# EAGLE schematic RPI Trivia Hat (EAGLE 7.2.0)
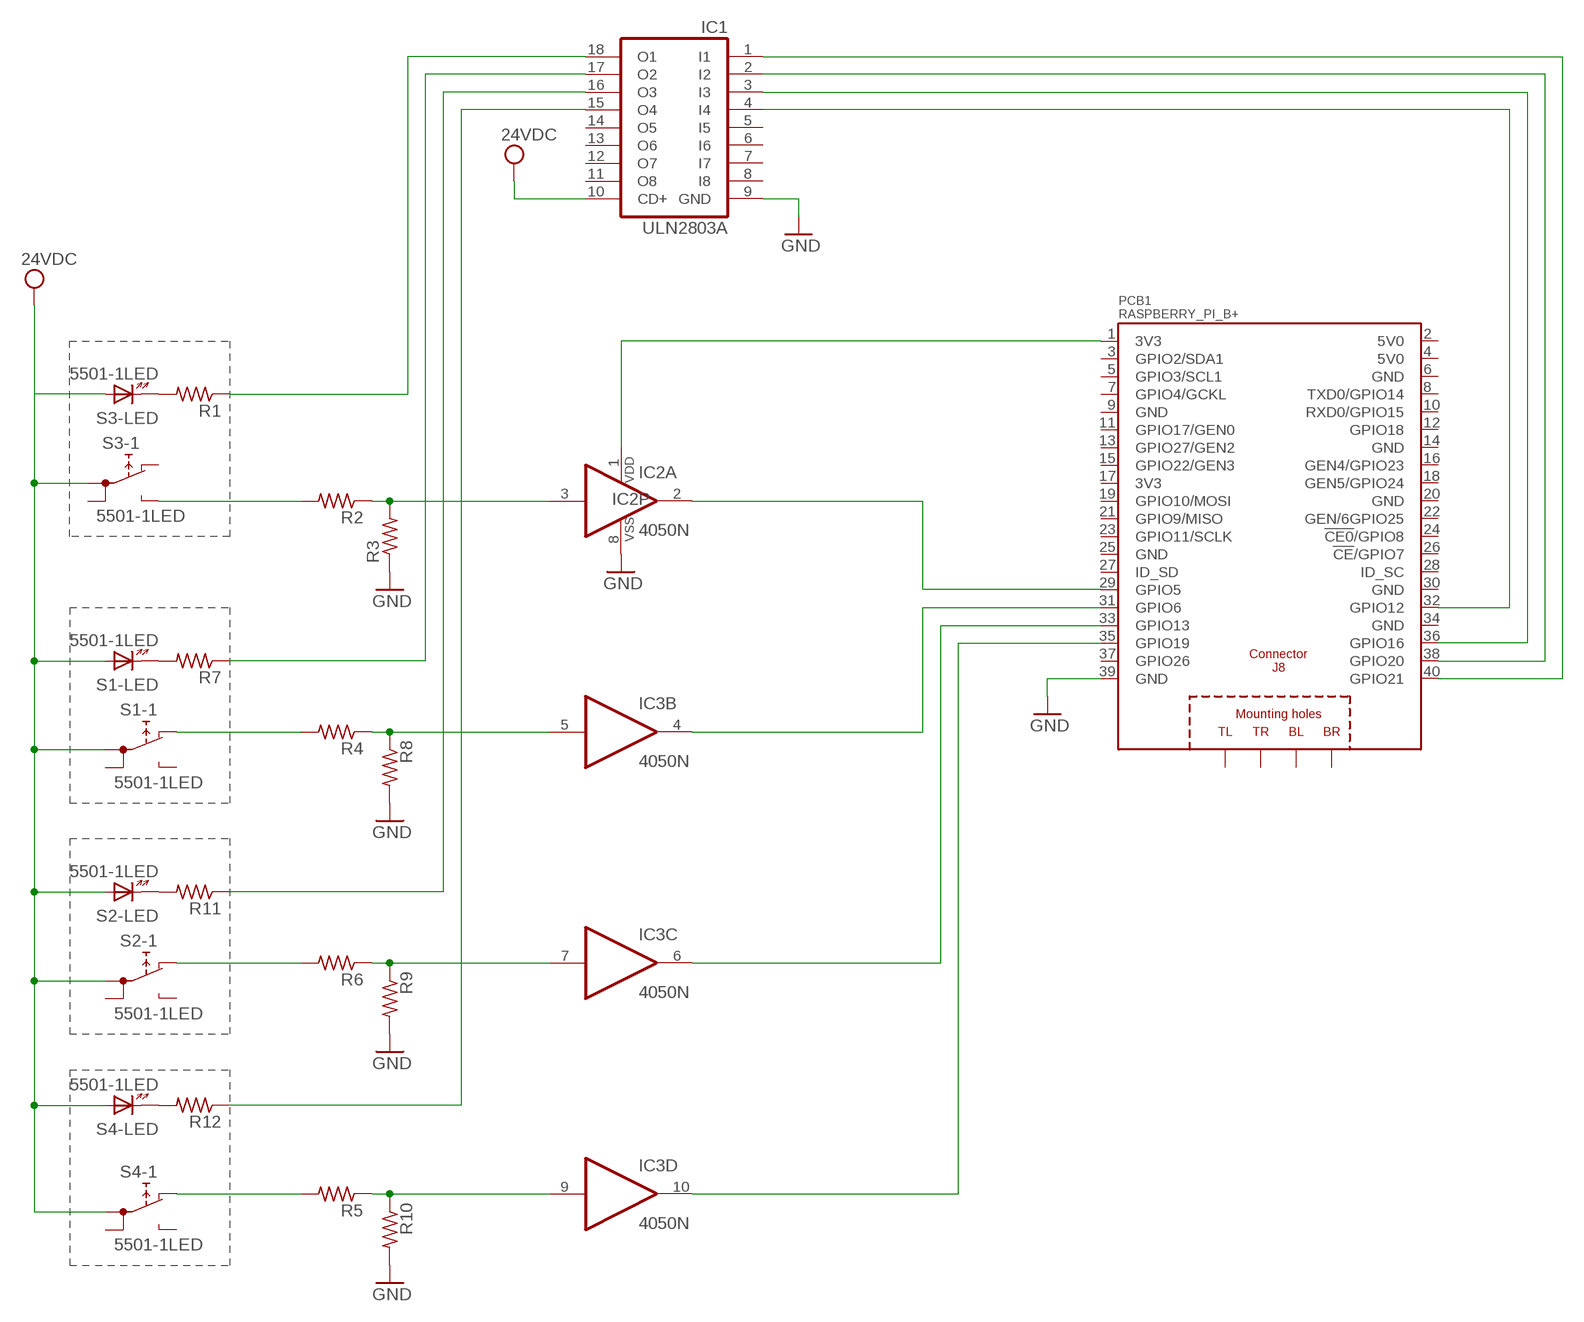
[diagram p0: schematic, sheet 1]

## Parts
IC1  ULN2803A  [DIL18]
IC2  4050N  [DIL16]
IC3  4050N  [DIL16]
PCB1  RASPBERRY_PI_B+  [RASPBERRY_PI_B+]
R1  R-US_0204/7  [0204/7]
R2  R-US_0204/7  [0204/7]
R3  R-US_0204/7  [0204/7]
R4  R-US_0204/7  [0204/7]
R5  R-US_0204/7  [0204/7]
R6  R-US_0204/7  [0204/7]
R7  R-US_0204/7  [0204/7]
R8  R-US_0204/7  [0204/7]
R9  R-US_0204/7  [0204/7]
R10  R-US_0204/7  [0204/7]
R11  R-US_0204/7  [0204/7]
R12  R-US_0204/7  [0204/7]
S1  5501-1LED  [5501-1LED]
S2  5501-1LED  [5501-1LED]
S3  5501-1LED  [5501-1LED]
S4  5501-1LED  [5501-1LED]

## Nets
3V3@1: IC2.1(P:VDD) PCB1.1(3V3)
GND: IC1.9(GND) IC2.8(P:VSS) PCB1.39(GND) R3.1 R8.2 R9.2 R10.2
N$1: R1.2 S3.-(-LED:K)
N$2: R2.2 S3.NO(-1:NO)
N$3: IC2.3(A:I) R2.1 R3.2
N$4: IC2.2(A:O) PCB1.29(GPIO5)
N$5: R4.2 S1.NC(-1:NC)
N$6: IC1.18(O1) R1.1
N$7: IC3.5(B:I) R4.1 R8.1
N$8: R6.2 S2.NC(-1:NC)
N$9: IC3.7(C:I) R6.1 R9.1
N$10: R5.2 S4.NC(-1:NC)
N$11: IC3.9(D:I) R5.1 R10.1
N$12: R7.2 S1.-(-LED:K)
N$13: R11.2 S2.-(-LED:K)
N$14: R12.2 S4.-(-LED:K)
N$15: IC1.15(O4) R12.1
N$16: IC3.4(B:O) PCB1.31(GPIO6)
N$17: IC3.6(C:O) PCB1.33(GPIO13)
N$18: IC3.10(D:O) PCB1.35(GPIO19)
N$19: IC1.17(O2) R7.1
N$20: IC1.16(O3) R11.1
N$21: IC1.1(I1) PCB1.40(GPIO21)
N$22: IC1.2(I2) PCB1.38(GPIO20)
N$23: IC1.3(I3) PCB1.36(GPIO16)
N$24: IC1.4(I4) PCB1.32(GPIO12)
VDD: IC1.10(CD+) S1.1A(-1:1A) S1.+(-LED:A) S2.1A(-1:1A) S2.+(-LED:A) S3.1A(-1:1A) S3.+(-LED:A) S4.1A(-1:1A) S4.+(-LED:A) ; supply symbol labelled 24VDC
Unconnected: IC1.5(I5) IC1.6(I6) IC1.7(I7) IC1.8(I8) IC1.11(O8) IC1.12(O7) IC1.13(O6) IC1.14(O5) IC2.4(B:O) IC2.5(B:I) IC2.6(C:O) IC2.7(C:I) IC2.9(D:I) IC2.10(D:O) IC2.11(E:I) IC2.12(E:O) IC2.14(F:I) IC2.15(F:O) IC3.2(A:O) IC3.3(A:I) IC3.11(E:I) IC3.12(E:O) IC3.14(F:I) IC3.15(F:O) PCB1.2(5V0) PCB1.3(GPIO2/SDA1) PCB1.4(5V0) PCB1.5(GPIO3/SCL1) PCB1.6(GND) PCB1.7(GPIO4/GCKL) PCB1.8(TXD0/GPIO14) PCB1.9(GND) PCB1.10(RXD0/GPIO15) PCB1.11(GPIO17/GEN0) PCB1.12(GPIO18) PCB1.13(GPIO27/GEN2) PCB1.14(GND) PCB1.15(GPIO22/GEN3) PCB1.16(GEN4/GPIO23) PCB1.17(3V3) PCB1.18(GEN5/GPIO24) PCB1.19(GPIO10/MOSI) PCB1.20(GND) PCB1.21(GPIO9/MISO) PCB1.22(GEN/6GPIO25) PCB1.23(GPIO11/SCLK) PCB1.24(!CE0!/GPIO8) PCB1.25(GND) PCB1.26(!CE!/GPIO7) PCB1.27(ID_SD) PCB1.28(ID_SC) PCB1.30(GND) PCB1.34(GND) PCB1.37(GPIO26) PCB1.PE_BL(BL) PCB1.PE_BR(BR) PCB1.PE_TL(TL) PCB1.PE_TR(TR) S1.1B(-1:1B) S1.NO(-1:NO) S2.1B(-1:1B) S2.NO(-1:NO) S3.1B(-1:1B) S3.NC(-1:NC) S4.1B(-1:1B) S4.NO(-1:NO)

## Power pins joined to a net without a drawn wire
VDD: IC3.1(P:VDD)
VSS: IC3.8(P:VSS)

## Library data of the parts
IC1 = uln-udn:ULN2803A: DRIVER ARRAY
IC2 IC3 = 40xx:4050: Hex non-inverting BUFFER
PCB1 = RASPBERRY_PI_Bplus:RASPBERRY_PI_B+: Raspberry Pi B+ Based on issue: Thursday, July 10, 2014 - Rev 1.2 LBR by Tim R. 07-2014
R1-R12 = resistor:R-US_: RESISTOR, American symbol
S1-S4 = switch:55?-1LED: PUSHBUTTON SERIES 5500 SWITCHES 1 LED Source: www.e-switch.com .. 5500.pdf